# EAGLE schematic LCD Adapter Board (EAGLE 9.5.2)
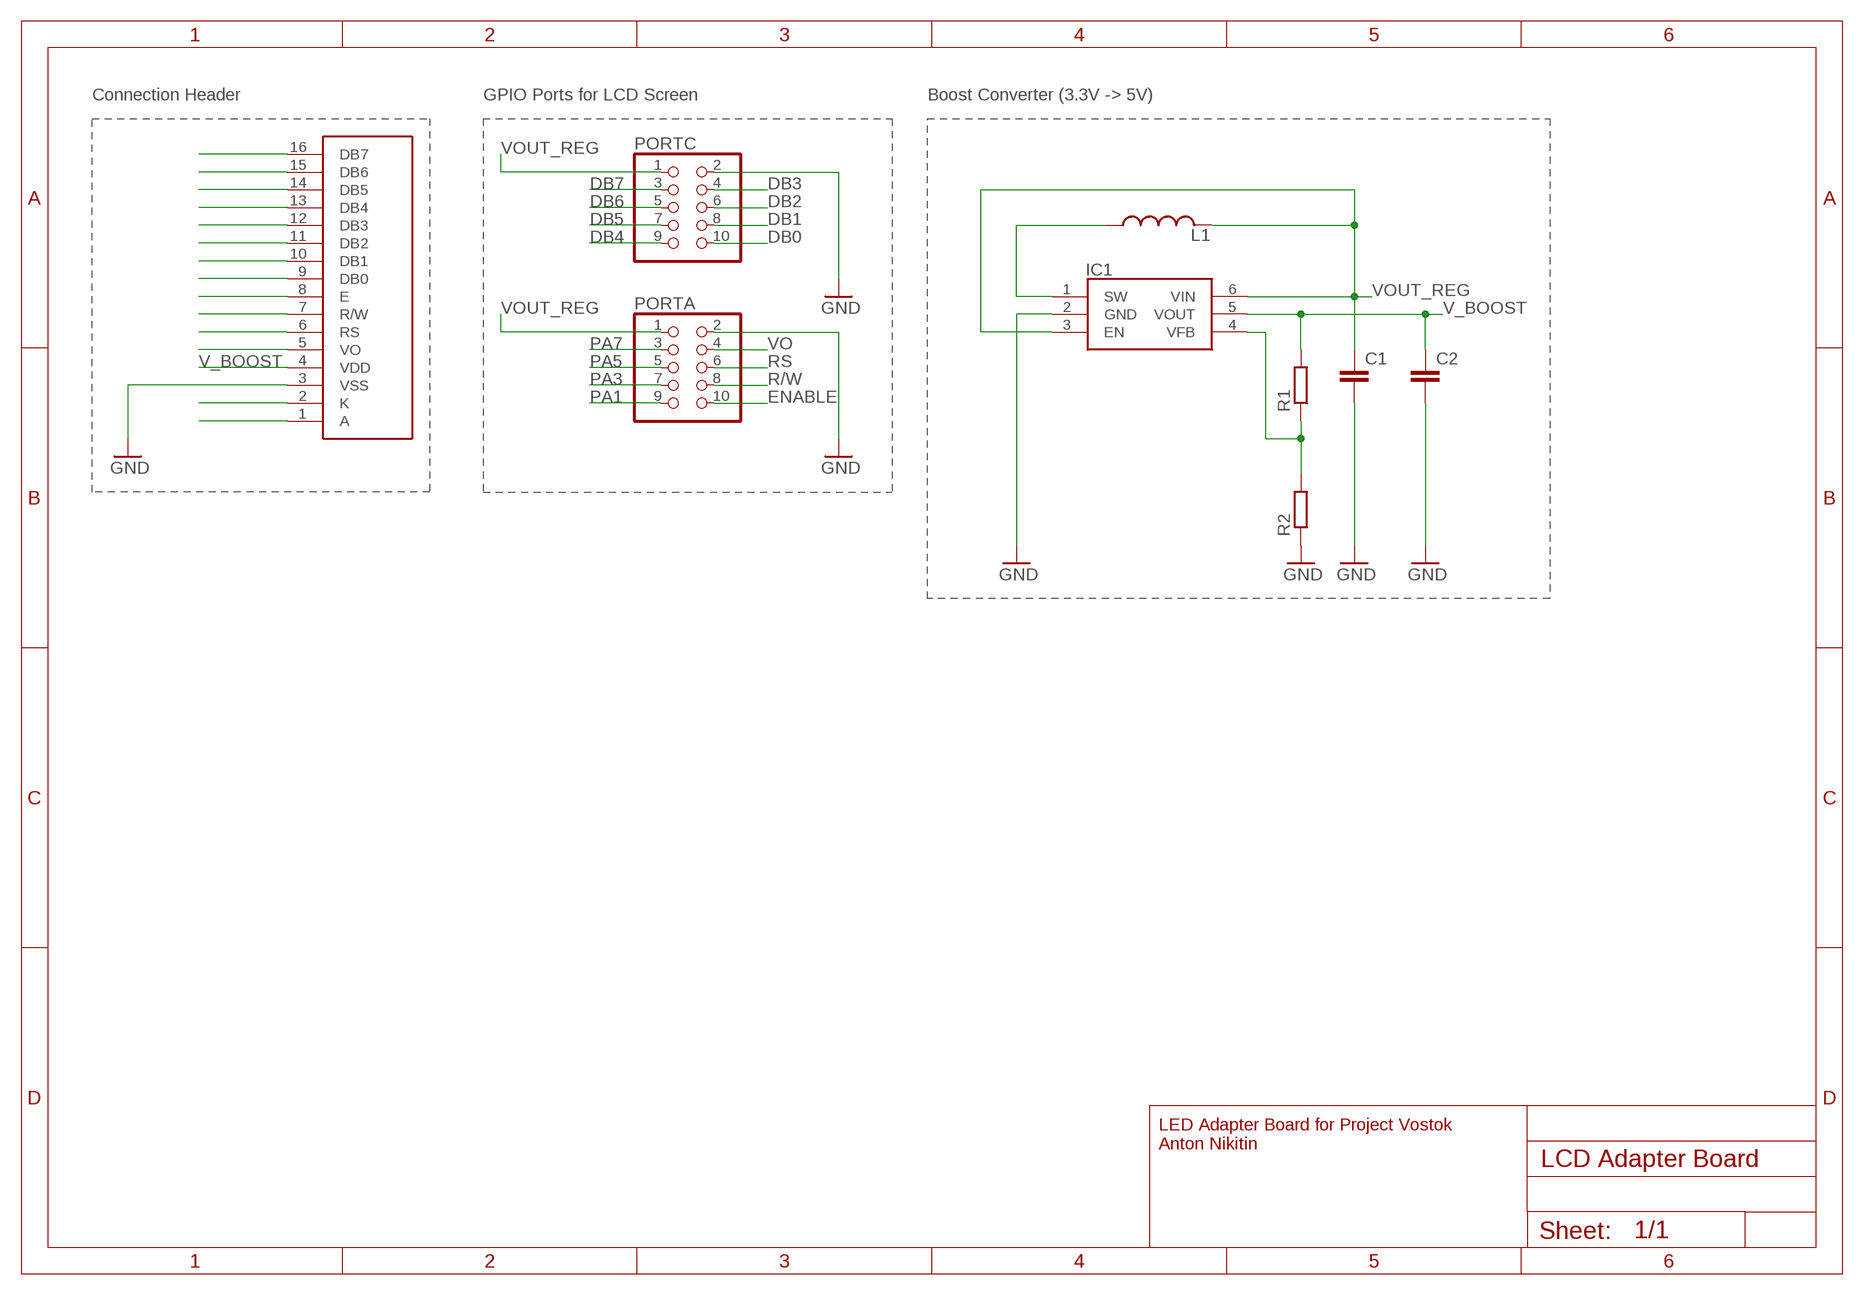
[diagram p0: schematic, sheet 1]

## Parts
C1  C-EUC0603  [C0603]
C2  C-EUC0603  [C0603]
DS1  162B-CC-BC-3LP  [162B]
IC1  MCP1640BT-I_CHY  [SOT95P270X145-6N]
L1  L-USL0201  [L0201]
PORTA  PINHD-2X5  [2X05]
PORTC  PINHD-2X5  [2X05]
R1  R-EU_R0603  [R0603]
R2  R-EU_R0603  [R0603]

## Nets
DB0: PORTC.10
DB1: PORTC.8
DB2: PORTC.6
DB3: PORTC.4
DB4: PORTC.9
DB5: PORTC.7
DB6: PORTC.5
DB7: PORTC.3
ENABLE: PORTA.10
GND: C1.2 C2.2 DS1.3(VSS) IC1.2(GND) PORTA.2 PORTC.2 R2.1
N$1: DS1.1(A)
N$2: DS1.2(K)
N$5: DS1.5(VO)
N$6: DS1.6(RS)
N$7: DS1.7(R/W)
N$8: DS1.8(E)
N$9: DS1.9(DB0)
N$10: DS1.10(DB1)
N$11: DS1.11(DB2)
N$12: DS1.12(DB3)
N$13: DS1.13(DB4)
N$14: DS1.14(DB5)
N$15: DS1.15(DB6)
N$16: DS1.16(DB7)
N$17: IC1.1(SW) L1.1
N$19: IC1.4(VFB) R1.1 R2.2
PA1: PORTA.9
PA3: PORTA.7
PA5: PORTA.5
PA7: PORTA.3
R/W: PORTA.8
RS: PORTA.6
V_BOOST: C2.1 DS1.4(VDD) IC1.5(VOUT) R1.2
VO: PORTA.4
VOUT_REG: C1.1 IC1.3(EN) IC1.6(VIN) L1.2 PORTA.1 PORTC.1

## Notes on the sheet
- Connection Header | GPIO Ports for LCD Screen | Boost Converter (3.3V -> 5V)
- LED Adapter Board for Project Vostok
  Anton Nikitin

## Library data of the parts
C1 C2 = rcl:C-EU: CAPACITOR, European symbol; SPICEPREFIX: C
DS1 = SamacSys_Parts:162B-CC-BC-3LP: 16x2 transflective STN blue/white,84x44 16x2 transflective STN blue/white,84x44 Source: Datasheet <http://docs-emea.rs-online.com/webdocs/06dd/0900766b806dda15.pdf>; DESCRIPTION: 16x2 transflective STN blue/white,84x44 16x2 transflective STN blue/white,84x44; HEIGHT: mm; MANUFACTURER_NAME: Displaytech; MANUFACTURER_PART_NUMBER: 162B-CC-BC-3LP; RS_PART_NUMBER: 5326385; RS_PRICE-STOCK: http://uk.rs-online.com/web/p/products/5326385
IC1 = SamacSys_Parts:MCP1640BT-I_CHY: Microchip MCP1640BT-I/CHY, Boost Converter, Step Up 0.35A Adjustable, 2 5.5 V, 575 kHz, 6-pin SOT-23 Source: Datasheet <http://docs-emea.rs-online.com/webdocs/137e/0900766b8137ea94.pdf>; ALLIED_NUMBER: 70047503; ALLIED_PRICE-STOCK: http://www.alliedelec.com/microchip-technology-inc-mcp1640bt-i-chy/70047503/; DESCRIPTION: Microchip MCP1640BT-I/CHY, Boost Converter, Step Up 0.35A Adjustable, 2 5.5 V, 575 kHz, 6-pin SOT-23; HEIGHT: 1.45mm; MANUFACTURER_NAME: Microchip; MANUFACTURER_PART_NUMBER: MCP1640BT-I/CHY; MOUSER_PART_NUMBER: 579-MCP1640BT-I/CHY; MOUSER_PRICE-STOCK: https://www.mouser.com/Search/Refine.aspx?Keyword=579-MCP1640BT-I%2FCHY; RS_PART_NUMBER: 7386250P; RS_PRICE-STOCK: http://uk.rs-online.com/web/p/products/7386250P
L1 = rcl:L-US: INDUCTOR, American symbol; SPICEPREFIX: L
PORTA PORTC = pinhead:PINHD-2X5: PIN HEADER
R1 R2 = rcl:R-EU_: RESISTOR, European symbol; SPICEPREFIX: R